# EasyEDA schematic SCH_Iris_OnBoardSystem_Schematic.json
TITLE: On Board Controller; REV: 1.3; Date: 2023-01-13; Sheet: 1/1; Drawn By: Avionics Dept.; Company: ASPiRE
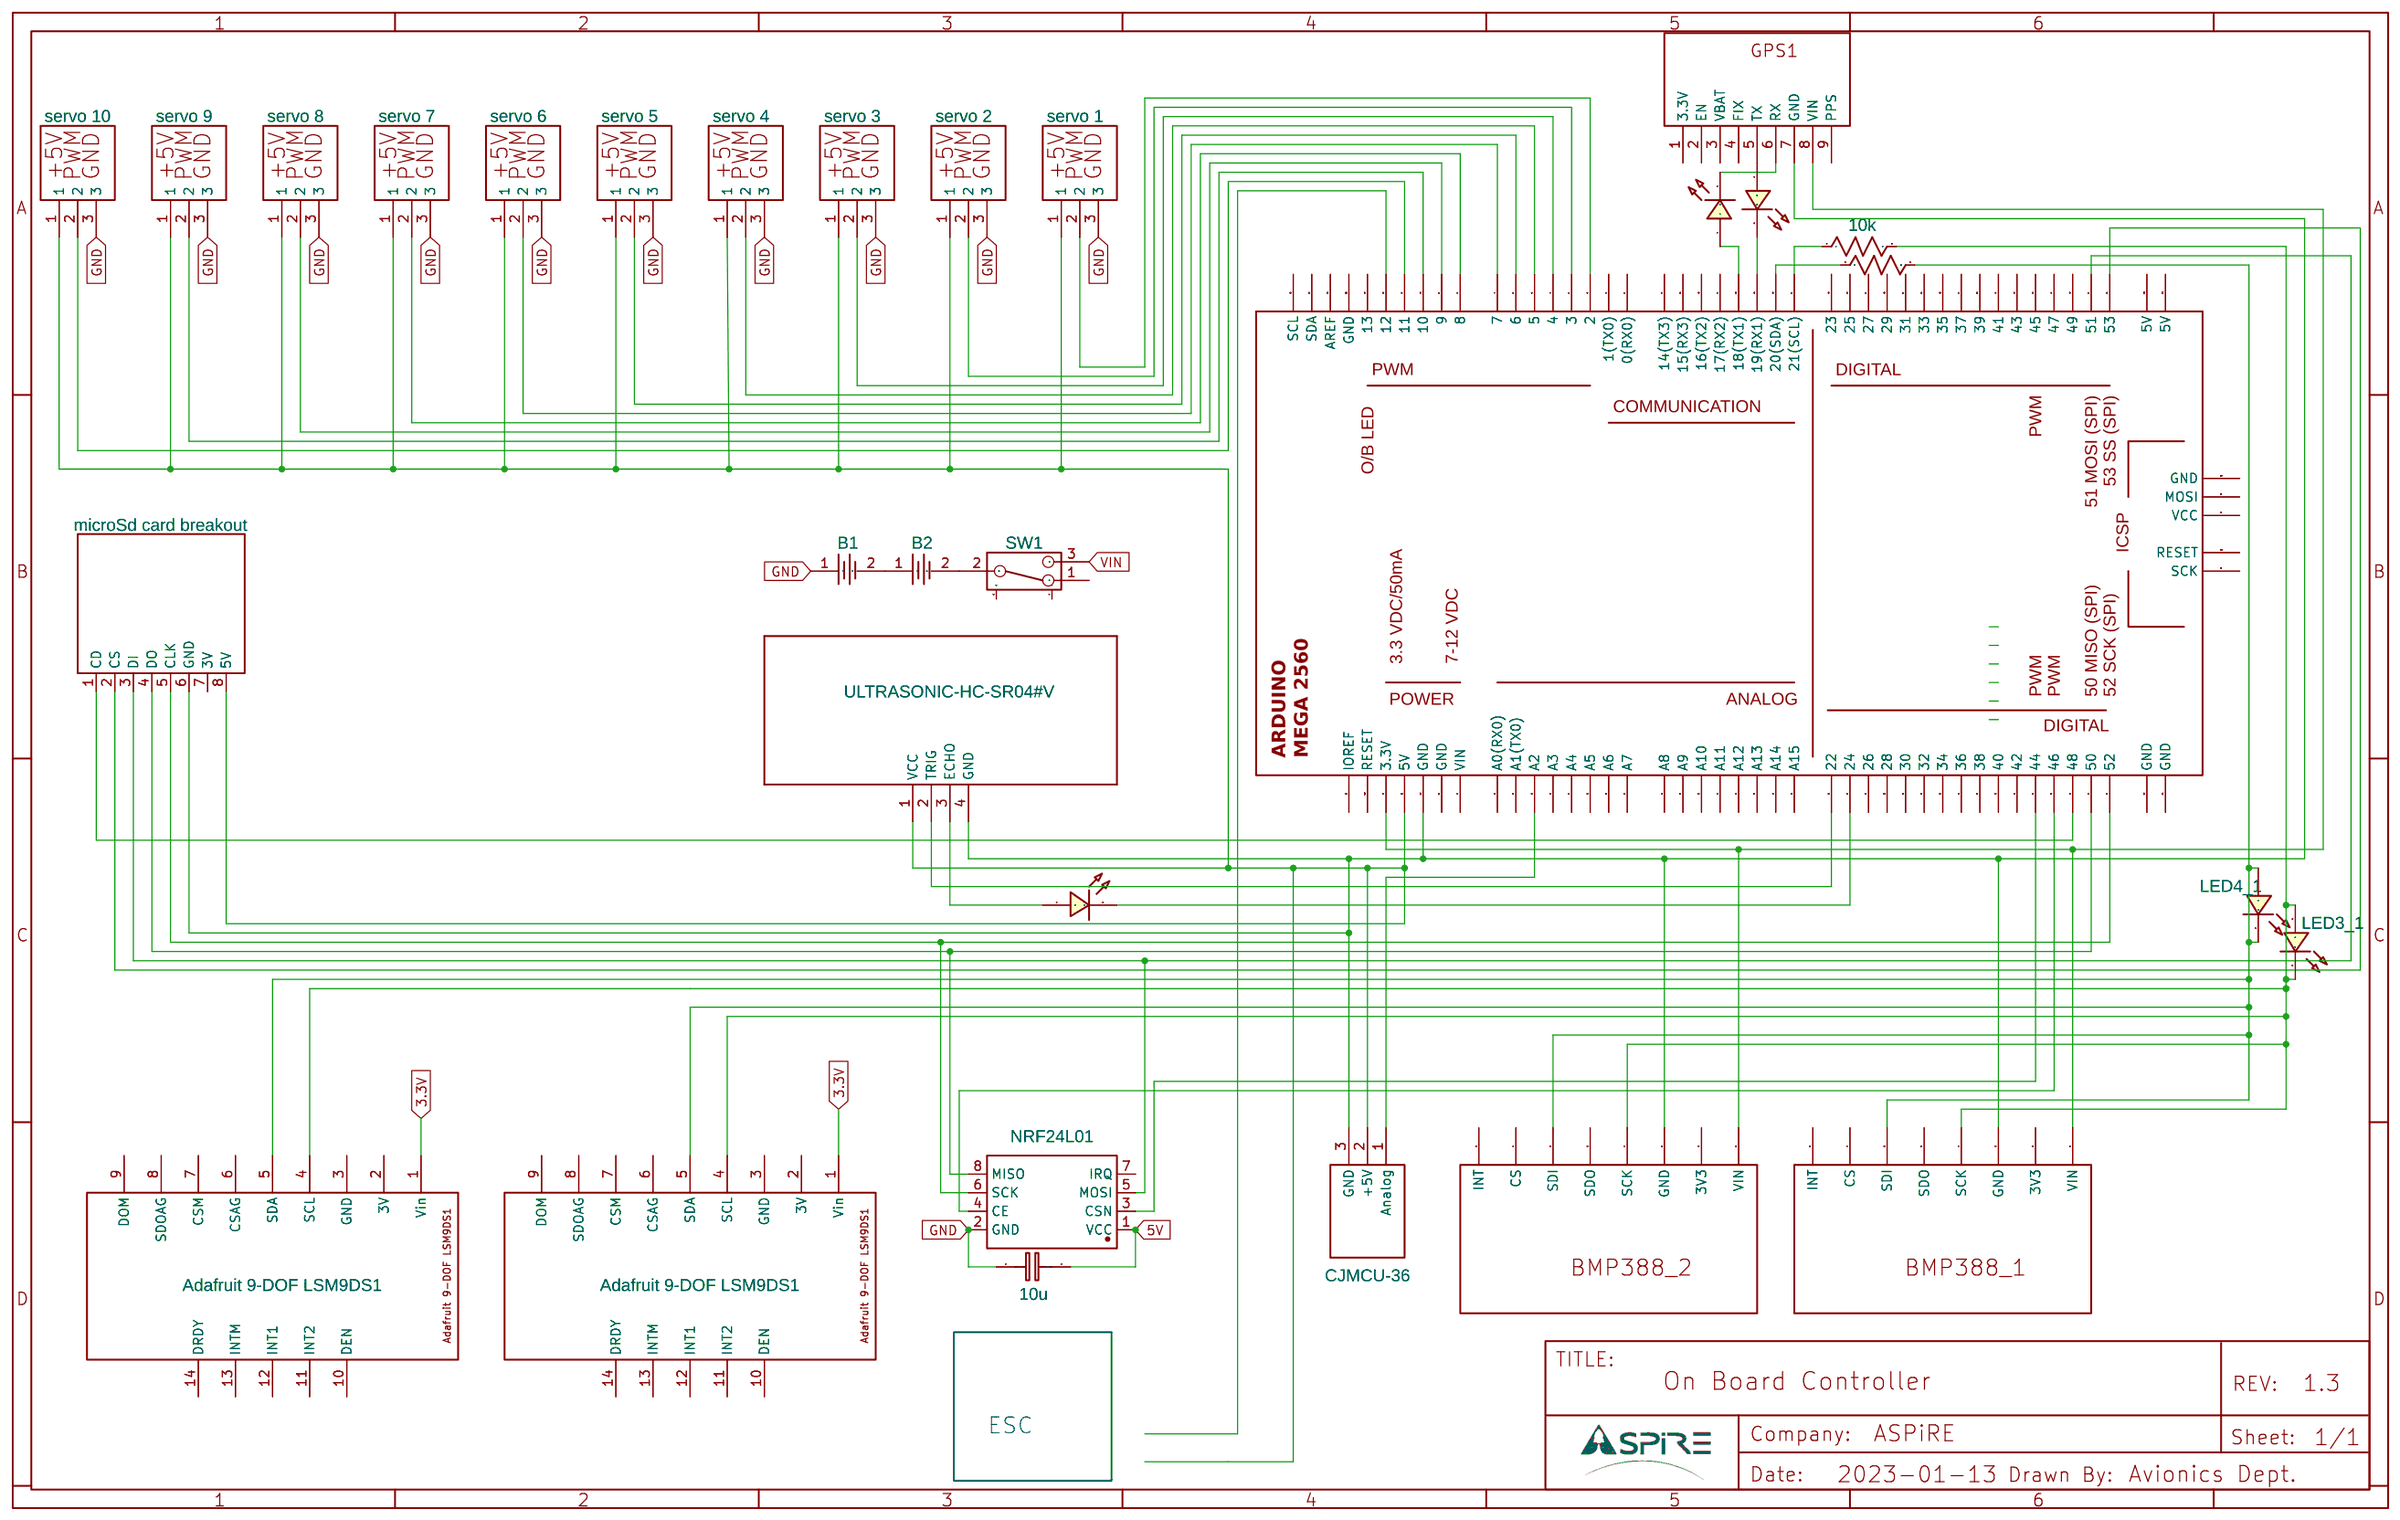
[diagram p0: schematic sheet]

## Parts
B1  CR1220-2  [BAT-SMD_CR1220-2]
B2  CR1220-2  [BAT-SMD_CR1220-2]
C1_1  10u  [RAD-0.1]
CD  microSd card breakout  [MICROSD CARD BREAKOUT BOARD+]
GPS1  ULTIMATE GPS MODULE  [ADAFRUIT ULTIMATE GPS BREAKOUT V3]
LED1_1  LED-TH-3mm_R  [LED-TH_BD3.0_RED]
LED2_1  LED-TH-3mm_R  [LED-TH_BD3.0_RED]
LED3_1  LED-TH-3mm_R  [LED-TH_BD3.0_RED]
LED4_1  LED-TH-3mm_R  [LED-TH_BD3.0_RED]
LED5_1  LED-TH-3mm_R  [LED-TH_BD3.0_RED]
MK1  NRF24L01  [WIRELM-SMD_NRF24L01]
R1_1  1k  [R_AXIAL-0.4]
R2_1  10k  [R_AXIAL-0.4]
SW1  SK-12D02-VG5  [SW-TH_SK-12D02VG3]
U1  Adafruit 9-DOF LSM9DS1  [ADAFRUIT 9-DOF LSM9DS1]
U4  ADAFRUIT_BMP388_1  [ADAFRUIT BMP388 BOARD]
U5  ADAFRUIT_BMP388_2  [ADAFRUIT BMP388 BOARD]
U6  Am  [ARDUINO MEGA 2560 REV3]
U15  Adafruit 9-DOF LSM9DS1  [ADAFRUIT 9-DOF LSM9DS1]
U16  CJMCU-36  [CJMCU-36]
U17  ULTRASONIC-HC-SR04#V  [ULTRASONIC-HC-SR04#V]
U18  servo 10  [SERVO]
U19  servo 9  [SERVO]
U20  servo 8  [SERVO]
U21  servo 7  [SERVO]
U22  servo 6  [SERVO]
U23  servo 5  [SERVO]
U24  servo 4  [SERVO]
U25  servo 3  [SERVO]
U26  servo 2  [SERVO]
U27  servo 1  [SERVO]

## Library data of the parts
B1 B2 = CR1220-2: Supplier: LCSC; Manufacturer: Q&J; image: //image.lceda.cn/szlcsc/C70381.jpg; Supplier Part: C70381
C1_1 = C_RAD-0.1_EU: Contributor: LCEDA_Lib
CD = microSd card breakout: Supplier: adafruit; Contributor: SergioOrellana
GPS1 = ULTIMATE GPS MODULE: Manufacturer: Crydom; Manufacturer Part: Solid State Relays; Supplier Part: 746; Supplier: Adafruit; link: https://www.adafruit.com/product/746; Contributor: otisbyron
LED1_1 LED2_1 LED3_1 LED4_1 LED5_1 = LED-TH-3mm_R: Manufacturer: EVERLIGHT(台湾亿光); Manufacturer Part: 204-10SDRD/S530-A3-L; Supplier Part: C84774; Supplier: LCSC; Contributor: LCEDA_Lib
MK1 = NRF24L01: Supplier: LCSC; Manufacturer: Ai-Thinker(安信可); Manufacturer Part: NF-04; Supplier Part: C90751; JLCPCB Part Class: Extended Part
R1_1 R2_1 = R_AXIAL-0.4_US: Contributor: LCEDA_Lib
SW1 = SK-12D02-VG5: Supplier: LCSC; Supplier Part: C136722; Manufacturer: Rectangular Connectors - Contacts; Contributor: LCSC
U1 U15 = Adafruit 9-DOF LSM9DS1: Manufacturer: Adafruit; Manufacturer Part: 4634; Supplier: Core Electronics; Supplier Part: ADA4634; Contributor: pyr0boy
U4 U5 = ADAFRUIT BMP388 BOARD COPY: Manufacturer: Bosch; Manufacturer Part: BMP388; Supplier: Adafruit; Supplier Part: 3966; link: https://www.adafruit.com/product/3966; Contributor: joshgarde
U6 = Am: Contributor: JJszlachcic
U16 = CJMCU-36: Contributor: tihomir.bozic
U17 = ULTRASONIC-HC-SR04#V: Ultrasonic Ranging Module HC-SR04; Contributor: erows
U18-U27 = servo: Contributor: hintz_

## Nets
3.3V: U1.1(Vin) U15.1(Vin)
5V: C1_1.2 MK1.1(VCC)
GND: B1.1 C1_1.1 MK1.2(GND) U18.3 U19.3 U20.3 U21.3 U22.3 U23.3 U24.3 U25.3 U26.3 U27.3
VIN: SW1.3
Net-(B1-2): B1.2 B2.1
Net-(B2-2): B2.2 SW1.2
Net-(CD-1): CD.1(CD) U6.48
Net-(CD-2): CD.2(CS) U6.53
Net-(CD-3): CD.3(DI) MK1.5(MOSI) U6.51
Net-(CD-4): CD.4(DO) MK1.8(MISO) U6.50
Net-(CD-5): CD.5(CLK) MK1.6(SCK) U6.52
Net-(CD-6): CD.6(GND) GPS1.7(GND) U4.3(GND) U5.3(GND) U6.GND@0(GND) U16.3(GND) U17.4(GND)
Net-(CD-8): CD.8(5V) U6.5V@0(5V) U16.2(+5V) U17.1(VCC) U18.1 U19.1 U20.1 U21.1 U22.1 U23.1 U24.1 U25.1 U26.1 U27.1
Net-(GPS1-5): GPS1.5(TX) LED2_1.1
Net-(GPS1-6): GPS1.6(RX) LED5_1.2
Net-(GPS1-8): GPS1.8(VIN) U4.1(VIN) U5.1(VIN) U6.3.3V
Net-(LED1_1-1): LED1_1.1 U17.3(ECHO)
Net-(LED1_1-2): LED1_1.2 U6.24
Net-(LED2_1-2): LED2_1.2 U6.19(19(RX1))
Net-(LED3_1-1): LED3_1.1 LED3_1.2 R2_1.2 U1.4(SCL) U4.4(SCK) U5.4(SCK) U15.4(SCL)
Net-(LED4_1-1): LED4_1.1 LED4_1.2 R1_1.2 U1.5(SDA) U4.6(SDI) U5.6(SDI) U15.5(SDA)
Net-(LED5_1-1): LED5_1.1 U6.18(18(TX1))
Net-(MK1-3): MK1.3(CSN) U6.44
Net-(MK1-4): MK1.4(CE) U6.46
Net-(R1_1-1): R1_1.1 U6.20(20(SDA))
Net-(R2_1-1): R2_1.1 U6.21(21(SCL))
Net-(U6-2): U6.2 U27.2
Net-(U6-3): U6.3 U26.2
Net-(U6-4): U6.4 U25.2
Net-(U6-5): U6.5 U24.2
Net-(U6-6): U6.6 U23.2
Net-(U6-7): U6.7 U22.2
Net-(U6-8): U6.8 U21.2
Net-(U6-9): U6.9 U20.2
Net-(U6-10): U6.10 U19.2
Net-(U6-11): U6.11 U18.2
Net-(U6-22): U6.22 U17.2(TRIG)
Net-(U6-A2): U6.A2 U16.1(Analog)

Not connected (* = marked no-connect by the designer): CD 7(3V); GPS1 1(3.3V) 2(EN) 3(VBAT) 4(FIX) 9(PPS); MK1 7(IRQ); SW1 1 4 5; U1 2(3V) 3(GND) 6(CSAG) 7(CSM) 8(SDOAG) 9(DOM) 10(DEN) 11(INT2) 12(INT1) 13(INTM) 14(DRDY); U4 2(3V3) 5(SDO) 7(CS) 8(INT); U5 2(3V3) 5(SDO) 7(CS) 8(INT); U6 0(0(RX0)) 1(1(TX0)) 5V@1(5V) 5V@2(5V) 12 13 14(14(TX3)) 15(15(RX3)) 16(16(TX2)) 17(17(RX2)) 23 25 26 27 28 29 30 31 32 33 34 35 36 37 38 39 40 41 42 43 45 47 49 A0(A0(RX0)) A1(A1(TX0)) A3 A4 A5 A6 A7 A8 A9 A10 A11 A12 A13 A14 A15 AREF GND@1(GND) GND@2(GND) GND@3(GND) GND@4(GND) GND@5(GND) IOREF MOSI RESET@0(RESET) RESET@1(RESET) SCK SCL SDA VCC VIN; U15 2(3V) 3(GND) 6(CSAG) 7(CSM) 8(SDOAG) 9(DOM) 10(DEN) 11(INT2) 12(INT1) 13(INTM) 14(DRDY)

## Notes on the sheet
- ESC
